# Altium schematic sheet [1]Shield.SchDoc
size A4; DocumentNumber: 2; SheetNumber: 2; SheetTotal: 4
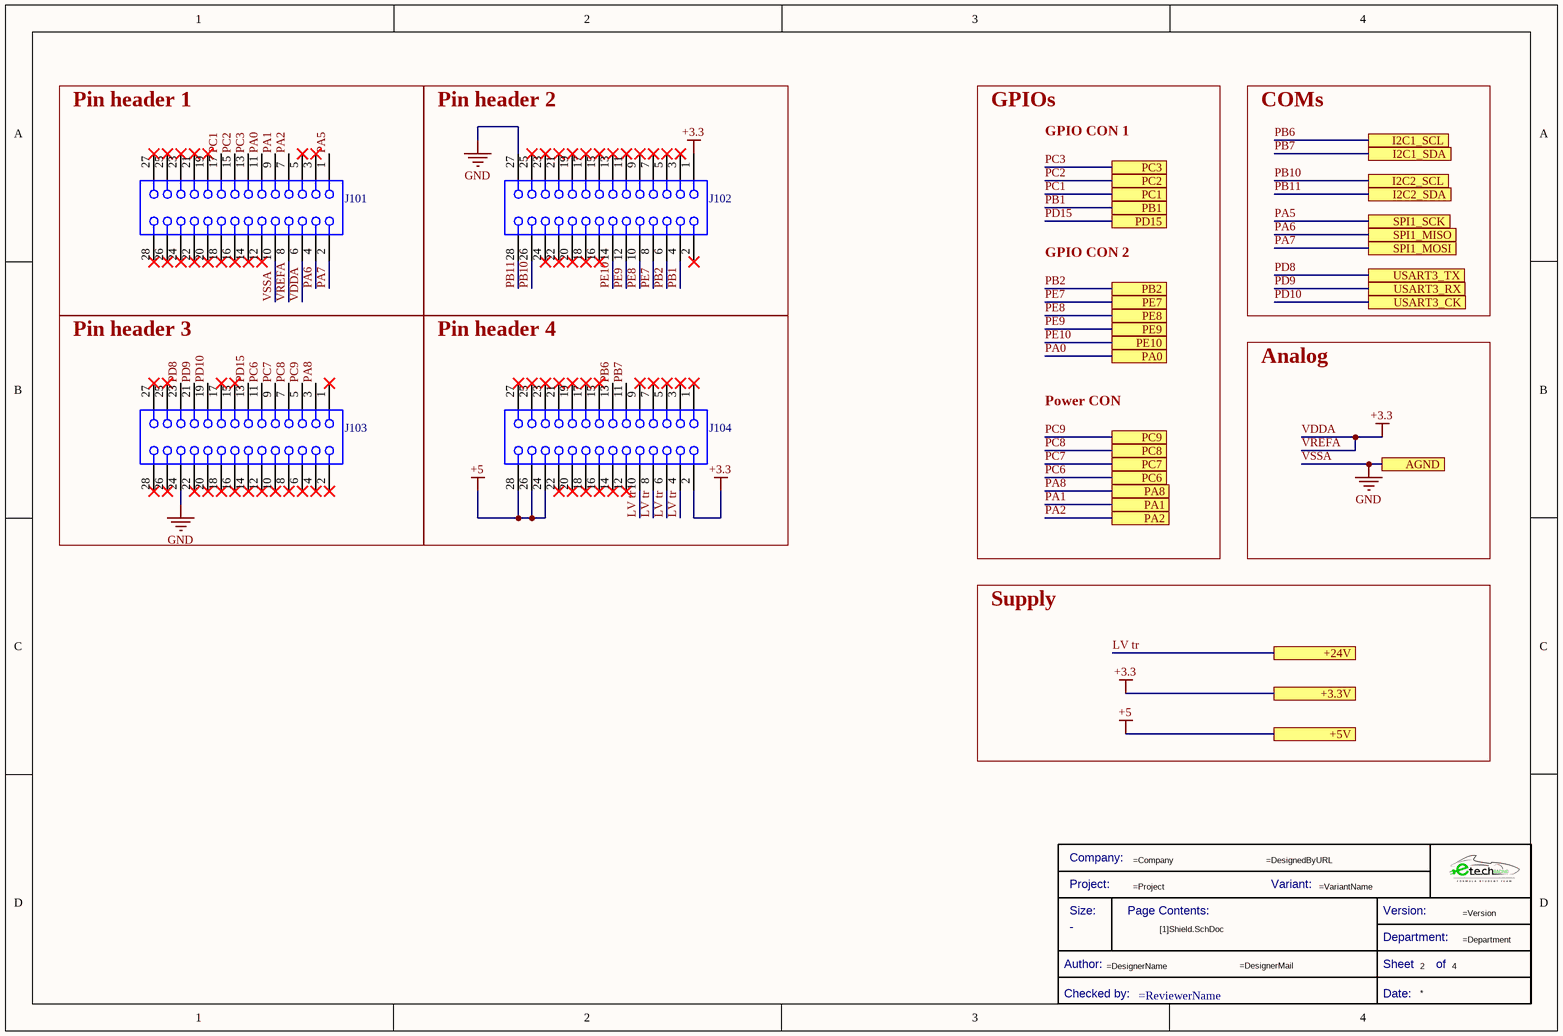
[diagram p0: [1]Shield.SchDoc]

## Parts
*  Title Block_template  (value not drawn)  (graphical)
J101  62332821021  [62332821021]  (value not drawn)
J102  62332821021  [62332821021]  (value not drawn)
J103  62332821021  [62332821021]  (value not drawn)
J104  62332821021  [62332821021]  (value not drawn)

## Blocks framed on the sheet
Pin header 1: J101
Pin header 2: J102
Pin header 3: J103
Pin header 4: J104

## Ports
+3.3V, +5V, +24V, AGND, I2C1_SCL, I2C1_SDA, I2C2_SCL, I2C2_SDA, PA0, PA1, PA2, PA8, PB1, PB2, PC1, PC2, PC3, PC6, PC7, PC8, PC9, PD15, PE7, PE8, PE9, PE10, SPI1_MISO, SPI1_MOSI, SPI1_SCK, USART3_CK, USART3_RX, USART3_TX

## Nets
+5: J104.24 J104.26 J104.28 ; port +5V
VDDA: J101.6 J101.8 J102.1 J104.2 ; port +3.3V  [also labelled +3.3, VREFA]
VSSA: J101.10 J102.27 J103.24 ; port AGND  [also labelled GND]
LV tr: J104.4 J104.6 J104.8 J104.10 ; port +24V
PA0: J101.11 ; port PA0
PA1: J101.9 ; port PA1
PA2: J101.7 ; port PA2
PA5: J101.1 ; port SPI1_SCK
PA6: J101.4 ; port SPI1_MISO
PA7: J101.2 ; port SPI1_MOSI
PA8: J103.3 ; port PA8
PB1: J102.4 ; port PB1
PB2: J102.6 ; port PB2
PB6: J104.13 ; port I2C1_SCL
PB7: J104.11 ; port I2C1_SDA
PB10: J102.26 ; port I2C2_SCL
PB11: J102.28 ; port I2C2_SDA
PC1: J101.17 ; port PC1
PC2: J101.15 ; port PC2
PC3: J101.13 ; port PC3
PC6: J103.11 ; port PC6
PC7: J103.9 ; port PC7
PC8: J103.7 ; port PC8
PC9: J103.5 ; port PC9
PD8: J103.23 ; port USART3_TX
PD9: J103.21 ; port USART3_RX
PD10: J103.19 ; port USART3_CK
PD15: J103.13 ; port PD15
PE7: J102.8 ; port PE7
PE8: J102.10 ; port PE8
PE9: J102.12 ; port PE9
PE10: J102.14 ; port PE10

Not connected (* = marked no-connect by the designer): J101 3* 5* 12* 14* 16* 18* 19* 20* 21* 22* 23* 24* 25* 26* 27* 28*; J102 2* 3* 5* 7* 9* 11* 13* 15* 16* 17* 18* 19* 20* 21* 22* 23* 24* 25*; J103 1* 2* 4* 6* 8* 10* 12* 14* 15* 16* 17* 18* 20* 22* 25* 26* 27* 28*; J104 1* 3* 5* 7* 9* 12* 14* 15* 16* 17* 18* 19* 20* 21* 22* 23* 25* 27*

## Notes on the sheet
- GPIOs
- COMs
- GPIO CON 1
- GPIO CON 2
- Analog
- Power CON
- Supply
- (in symbol Title Block_template) Company:; Project:; Variant:; Size:; Page Contents:; Version:; Department:; Author:; Sheet; of; Checked by:; Date:

## Library data of the parts
* = Title Block_template: Standard Title Block; .Creator: GP; Category: Title Block; .PCBcheck: GP; .SCHcheck: GP; Checked by:: =ReviewerName; Size: -
J101-J104 = 62332821021: WR-PHD Socket Header, SMT, Vertical, pitch 1.27mm, 2 Row, 28P; Manufacturer: Wurth Elektronik; Contact Resistance: 20mΩ; Rated Current: 1A; Working Voltage: 250V; Withstanding Voltage: 500V; ComponentLink1Description: Website Link; ComponentLink1URL: https://www.we-online.com/redexpert/article/62332821021?ad; ComponentLink2Description: Datasheet Link; ComponentLink2URL: https://www.we-online.com/redexpert/spec/62332821021?ad; Manufacturer Part Number: 62332821021; Category: Board-to-Board Connectors; Match Code: WR-PHD; Mount: Surface Mount; Operating Temperature Max: 105°C; Operating Temperature Min: -40°C; Packaging: Tape and Reel; Gender: Socket Header; Number of Pins: 28; Number of Rows: 2; Orientation: Vertical; Pitch: 1.27mm